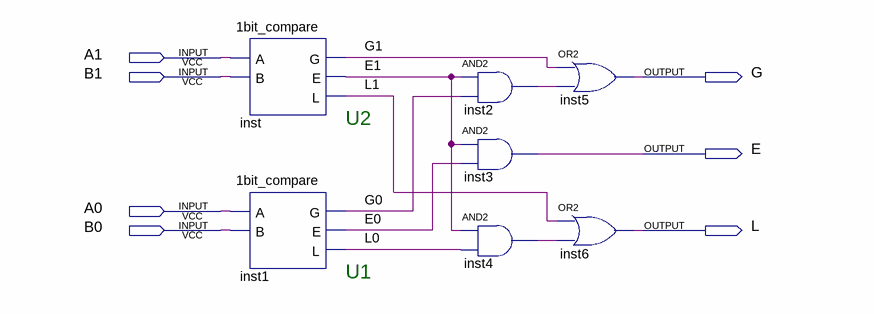
[diagram p0: schematic sheet]
// Quartus schematic 2bit_compare_S.bdf as structural Verilog: 7 symbols, 7 pins
module \2bit_compare_S  (
  input  A1,
  input  B1,
  input  A0,
  input  B0,
  output G,
  output E,
  output L
);

  wire E0, E1, G0, G1, inst2_out, inst4_out, L0, L1;

  \1bit_compare  inst (.A(A1), .B(B1), .G(G1), .E(E1), .L(L1));
  \1bit_compare  inst1 (.A(A0), .B(B0), .G(G0), .E(E0), .L(L0));
  and inst2 (inst2_out, E1, G0);
  and inst3 (E, E1, E0);
  and inst4 (inst4_out, E1, L0);
  or inst5 (G, G1, inst2_out);
  or inst6 (L, L1, inst4_out);

  // Notes on the sheet:
  //   U2
  //   U1
endmodule
